# Altium schematic sheet Sheet6.SchDoc
size A4; Organization: Altium Limited; Address1: L3, 12a Rodborough Rd; Address2: Frenchs Forest; Address3: NSW; Address4: Australia 2086
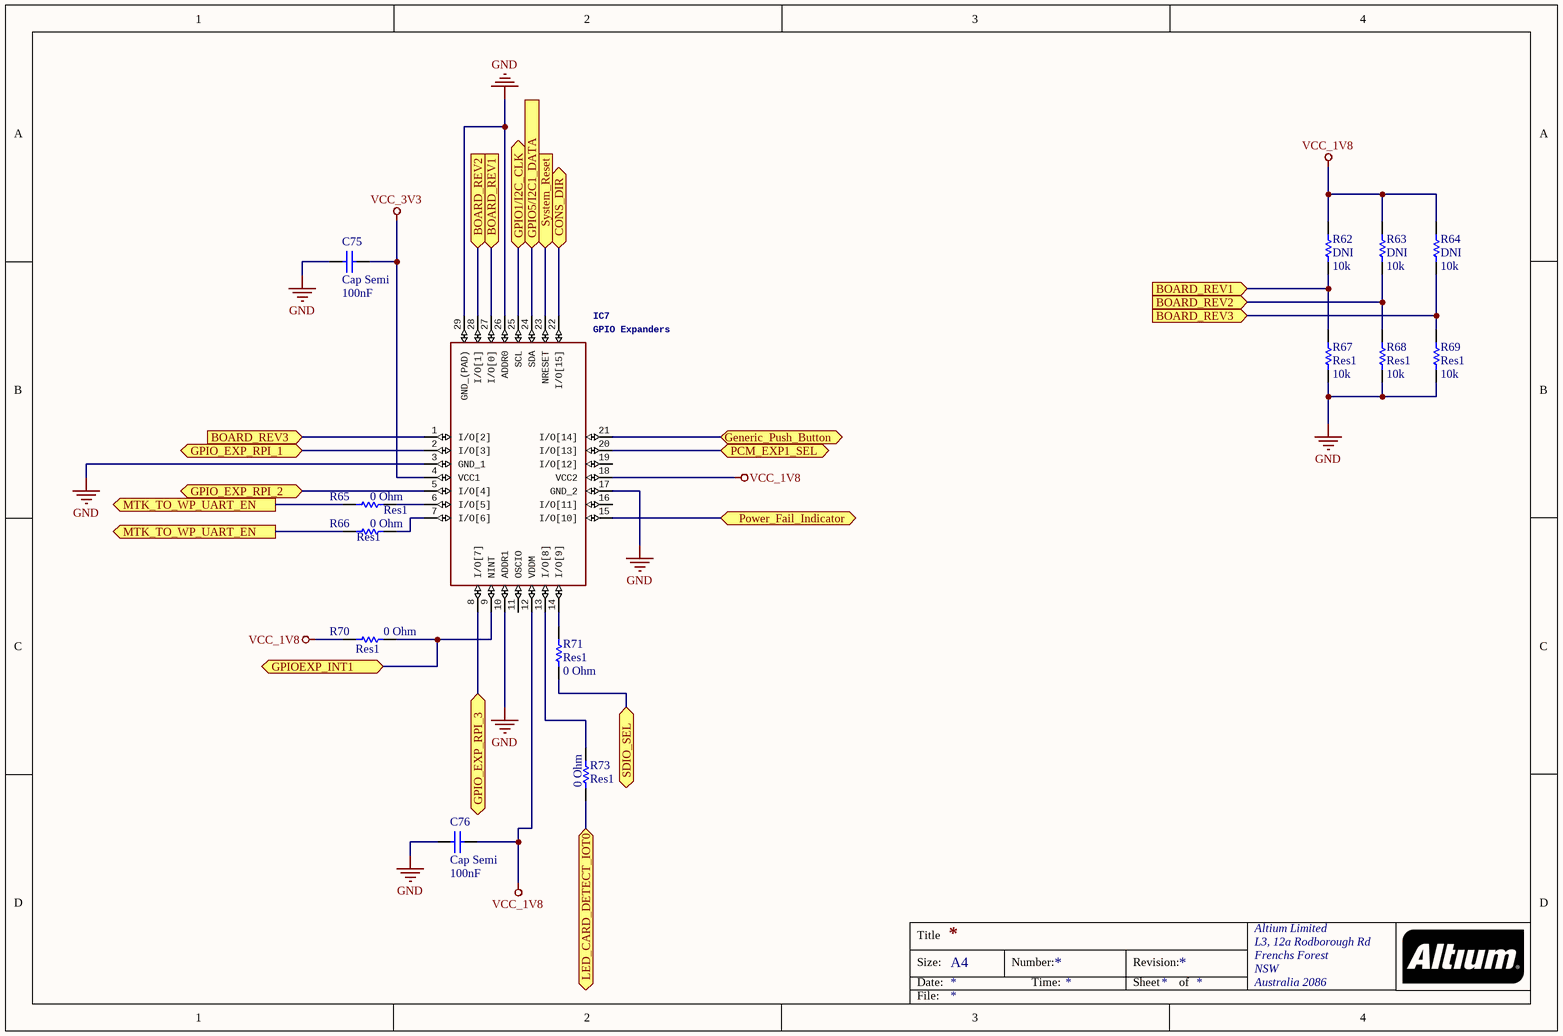
[diagram p0: Sheet6.SchDoc]

## Parts
C75  Cap Semi  value 100nF  [CAP 0402/1005]
C76  Cap Semi  value 100nF  [CAP 0402/1005]
IC7  GPIO Expanders  [QFN40P400X400X60-29N]
R62  DNI  value 10k  [RES 0402/1005]
R63  DNI  value 10k  [RES 0402/1005]
R64  DNI  value 10k  [RES 0402/1005]
R65  Res1  value 0 Ohm  [RES 0402/1005]
R66  Res1  value 0 Ohm  [RES 0402/1005]
R67  Res1  value 10k  [RES 0402/1005]
R68  Res1  value 10k  [RES 0402/1005]
R69  Res1  value 10k  [RES 0402/1005]
R70  Res1  value 0 Ohm  [RES 0402/1005]
R71  Res1  value 0 Ohm  [RES 0402/1005]
R73  Res1  value 0 Ohm  [RES 0402/1005]

## Ports
BOARD_REV1 (in), BOARD_REV2 (in), BOARD_REV3 (in), CONS_DIR (bidir), Generic_Push_Button (bidir), GPIO1/I2C_CLK (bidir), GPIO5/I2C1_DATA (in), GPIO_EXP_RPI_1 (bidir), GPIO_EXP_RPI_2 (bidir), GPIO_EXP_RPI_3 (bidir), GPIOEXP_INT1 (bidir), LED_CARD_DETECT_IOT0 (bidir), MTK_TO_WP_UART_EN (out), PCM_EXP1_SEL (bidir), Power_Fail_Indicator (bidir), SDIO_SEL (bidir), System_Reset (in)

## Nets
GND: C75.2 C76.2 IC7.3(GND_1) IC7.10(ADDR1) IC7.17(GND_2) IC7.26(ADDR0) IC7.29(GND_(PAD)) R67.2 R68.2 R69.2
VCC_1V8: C76.1 IC7.12(VDDM) IC7.18(VCC2) R62.1 R63.1 R64.1 R70.1
VCC_3V3: C75.1 IC7.4(VCC1)
BOARD_REV1: IC7.27(I/O[0]) R62.2 R67.1 ; port BOARD_REV1
BOARD_REV2: IC7.28(I/O[1]) R63.2 R68.1 ; port BOARD_REV2
BOARD_REV3: IC7.1(I/O[2]) R64.2 R69.1 ; port BOARD_REV3
CONS_DIR: IC7.22(I/O[15]) ; port CONS_DIR
Generic_Push_Button: IC7.21(I/O[14]) ; port Generic_Push_Button
GPIO1/I2C_CLK: IC7.25(SCL) ; port GPIO1/I2C_CLK
GPIO5/I2C1_DATA: IC7.24(SDA) ; port GPIO5/I2C1_DATA
GPIO_EXP_RPI_1: IC7.2(I/O[3]) ; port GPIO_EXP_RPI_1
GPIO_EXP_RPI_2: IC7.5(I/O[4]) ; port GPIO_EXP_RPI_2
GPIO_EXP_RPI_3: IC7.8(I/O[7]) ; port GPIO_EXP_RPI_3
GPIOEXP_INT1: IC7.9(NINT) R70.2 ; port GPIOEXP_INT1
LED_CARD_DETECT_IOT0: R73.2 ; port LED_CARD_DETECT_IOT0
MTK_TO_WP_UART_EN: R65.2 R66.2 ; port MTK_TO_WP_UART_EN
PCM_EXP1_SEL: IC7.20(I/O[13]) ; port PCM_EXP1_SEL
Power_Fail_Indicator: IC7.15(I/O[10]) ; port Power_Fail_Indicator
SDIO_SEL: R71.2 ; port SDIO_SEL
System_Reset: IC7.23(NRESET) ; port System_Reset
NetIC7_6: IC7.6(I/O[5]) R65.1
NetIC7_7: IC7.7(I/O[6]) R66.1
NetIC7_13: IC7.13(I/O[8]) R73.1
NetIC7_14: IC7.14(I/O[9]) R71.1

Not connected (* = marked no-connect by the designer): IC7 11(OSCIO) 16(I/O[11]) 19(I/O[12])

## Notes on the sheet
- Title
- Size:
- Date:
- A4
- Number:
- Time:
- Revision:
- Sheet
- of
- File:

## Library data of the parts
C75 C76 = Cap Semi: Capacitor (Semiconductor SIM Model); Part Number: LMK105BJ104KV-F; Published: 8-Jun-2000; LatestRevisionDate: 29-May-2009; LatestRevisionNote: IPC-7351 Footprint Added.; PackageReference: C1206; PackageDescription: Chip Capacitor
IC7 = SX1509BIULTRT: Manufacturer_Name: SEMTECH; GateName_1: G$1; SymbolName_1: SX1509BIULTRT; LibraryName: SX1509BIULTRT; DeviceSetName: SX1509BIULTRT; Package: QFN40P400X400X60-29N; Manufacturer_Part_Number: SX1509BIULTRT; Mouser_Part_Number: 947-SX1509BIULTRT; Mouser_Price-Stock: https://www.mouser.com/Search/Refine.aspx?Keyword=947-SX1509BIULTRT; Height: 0.6mm
R62-R64 R67-R69 = Res1: Resistor; Part Number: MCR01MZPF1002; Published: 8-Jun-2000; LatestRevisionDate: 17-Jul-2002; LatestRevisionNote: Re-released for DXP Platform.; PackageReference: AXIAL-0.3; PackageDescription: Axial Device, Thru-Hole; 2 Leads; 0.3 in Pin Spacing
R65 R66 R70 R71 R73 = Res1: Resistor; Part Number: RK73Z1ETTP; Published: 8-Jun-2000; LatestRevisionDate: 17-Jul-2002; LatestRevisionNote: Re-released for DXP Platform.; PackageReference: AXIAL-0.3; PackageDescription: Axial Device, Thru-Hole; 2 Leads; 0.3 in Pin Spacing